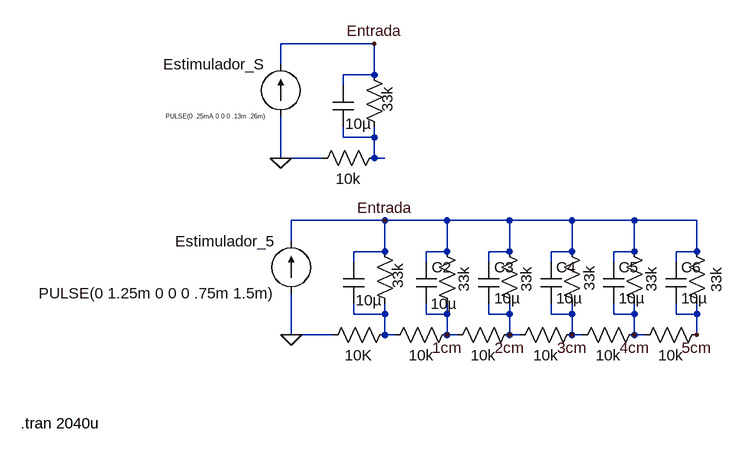
[diagram p0: schematic Simulacion Nervio Vago.asc]
Simulacion Nervio Vago.asc, the LTspice schematic file:
Version 4
SHEET 1 880 680
WIRE -32 -224 -176 -224
WIRE -176 -192 -176 -224
WIRE -32 -176 -32 -224
WIRE -32 -176 -80 -176
WIRE -80 -160 -80 -176
WIRE -80 -80 -80 -96
WIRE -32 -80 -32 -96
WIRE -32 -80 -80 -80
WIRE -176 -48 -176 -112
WIRE -112 -48 -176 -48
WIRE -32 -48 -32 -80
WIRE -16 -48 -32 -48
WIRE -16 48 -160 48
WIRE 80 48 -16 48
WIRE 176 48 80 48
WIRE 272 48 176 48
WIRE 368 48 272 48
WIRE 464 48 368 48
WIRE -160 80 -160 48
WIRE -16 96 -16 48
WIRE -16 96 -64 96
WIRE 80 96 80 48
WIRE 80 96 48 96
WIRE 176 96 176 48
WIRE 176 96 144 96
WIRE 272 96 272 48
WIRE 272 96 240 96
WIRE 368 96 368 48
WIRE 368 96 336 96
WIRE 464 96 464 48
WIRE 464 96 432 96
WIRE -64 112 -64 96
WIRE 48 112 48 96
WIRE 144 112 144 96
WIRE 240 112 240 96
WIRE 336 112 336 96
WIRE 432 112 432 96
WIRE -64 192 -64 176
WIRE -16 192 -16 176
WIRE -16 192 -64 192
WIRE 48 192 48 176
WIRE 80 192 80 176
WIRE 80 192 48 192
WIRE 144 192 144 176
WIRE 176 192 176 176
WIRE 176 192 144 192
WIRE 240 192 240 176
WIRE 272 192 272 176
WIRE 272 192 240 192
WIRE 336 192 336 176
WIRE 368 192 368 176
WIRE 368 192 336 192
WIRE 432 192 432 176
WIRE 464 192 464 176
WIRE 464 192 432 192
WIRE -160 224 -160 160
WIRE -96 224 -160 224
WIRE -16 224 -16 192
WIRE 0 224 -16 224
WIRE 80 224 80 192
WIRE 96 224 80 224
WIRE 176 224 176 192
WIRE 192 224 176 224
WIRE 272 224 272 192
WIRE 288 224 272 224
WIRE 368 224 368 192
WIRE 384 224 368 224
WIRE 464 224 464 192
FLAG -160 224 0
FLAG -16 48 Entrada
FLAG 80 224 1cm
FLAG 176 224 2cm
FLAG 272 224 3cm
FLAG 368 224 4cm
FLAG 464 224 5cm
FLAG -176 -48 0
FLAG -32 -224 Entrada
SYMBOL res 160 80 R0
WINDOW 0 0 0 Invisible 2
WINDOW 3 42 39 VRight 2
SYMATTR InstName R1
SYMATTR Value 33k
SYMBOL res 256 80 R0
WINDOW 0 0 1 Invisible 2
WINDOW 3 43 38 VRight 2
SYMATTR InstName R2
SYMATTR Value 33k
SYMBOL res 352 80 R0
WINDOW 0 -1 1 Invisible 2
WINDOW 3 42 39 VRight 2
SYMATTR InstName R3
SYMATTR Value 33k
SYMBOL res 448 80 R0
WINDOW 0 1 -1 Invisible 2
WINDOW 3 46 40 VRight 2
SYMATTR InstName R4
SYMATTR Value 33k
SYMBOL res 64 80 R0
WINDOW 0 0 1 Invisible 2
WINDOW 3 42 39 VRight 2
SYMATTR InstName R5
SYMATTR Value 33k
SYMBOL res -32 80 R0
WINDOW 0 2 -1 Invisible 2
WINDOW 3 36 34 VRight 2
SYMATTR InstName R6
SYMATTR Value 33k
SYMBOL res 96 208 R90
WINDOW 0 0 56 Invisible 2
WINDOW 3 32 56 VTop 2
SYMATTR InstName R7
SYMATTR Value 10k
SYMBOL res 192 208 R90
WINDOW 0 0 56 Invisible 2
WINDOW 3 32 56 VTop 2
SYMATTR InstName R8
SYMATTR Value 10k
SYMBOL res 288 208 R90
WINDOW 0 0 56 Invisible 2
WINDOW 3 32 56 VTop 2
SYMATTR InstName R9
SYMATTR Value 10k
SYMBOL res 384 208 R90
WINDOW 0 0 56 Invisible 2
WINDOW 3 32 56 VTop 2
SYMATTR InstName R10
SYMATTR Value 10k
SYMBOL res 480 208 R90
WINDOW 0 0 56 Invisible 2
WINDOW 3 32 56 VTop 2
SYMATTR InstName R11
SYMATTR Value 10k
SYMBOL cap -80 112 R0
WINDOW 3 19 59 Left 2
WINDOW 0 24 8 Invisible 2
SYMATTR Value 10µ
SYMATTR InstName C1
SYMBOL cap 32 112 R0
WINDOW 3 23 64 Left 2
SYMATTR Value 10µ
SYMATTR InstName C2
SYMBOL cap 128 112 R0
SYMATTR InstName C3
SYMATTR Value 10µ
SYMBOL cap 224 112 R0
SYMATTR InstName C4
SYMATTR Value 10µ
SYMBOL cap 320 112 R0
SYMATTR InstName C5
SYMATTR Value 10µ
SYMBOL cap 416 112 R0
SYMATTR InstName C6
SYMATTR Value 10µ
SYMBOL current -160 160 R180
WINDOW 0 24 80 Left 2
WINDOW 3 24 0 Left 2
WINDOW 123 0 0 Left 0
WINDOW 39 0 0 Left 0
SYMATTR InstName Estimulador_5
SYMATTR Value PULSE(0 1.25m 0 0 0 .75m 1.5m)
SYMBOL res 0 208 R90
WINDOW 0 0 56 Invisible 2
WINDOW 3 32 56 VTop 2
SYMATTR InstName R12
SYMATTR Value 10K
SYMBOL res -48 -192 R0
WINDOW 0 2 -1 Invisible 2
WINDOW 3 36 34 VRight 2
SYMATTR InstName R13
SYMATTR Value 33k
SYMBOL cap -96 -160 R0
WINDOW 3 19 59 Left 2
WINDOW 0 24 8 Invisible 2
SYMATTR Value 10µ
SYMATTR InstName C7
SYMBOL current -176 -112 R180
WINDOW 0 24 80 Left 2
WINDOW 3 24 0 Left 0
WINDOW 123 0 0 Left 0
WINDOW 39 0 0 Left 0
SYMATTR InstName Estimulador_S
SYMATTR Value PULSE(0 .25mA 0 0 0 .13m .26m)
SYMBOL res -16 -64 R90
WINDOW 0 0 56 Invisible 2
WINDOW 3 32 56 VTop 2
SYMATTR InstName R14
SYMATTR Value 10k
TEXT -576 360 Left 2 !.tran 2040u

The netlist it stands for:
* Simulacion Nervio Vago.asc
R1 Entrada 2cm 33k
R2 Entrada 3cm 33k
R3 Entrada 4cm 33k
R4 Entrada 5cm 33k
R5 Entrada 1cm 33k
R6 Entrada N002 33k
R7 1cm N002 10k
R8 2cm 1cm 10k
R9 3cm 2cm 10k
R10 4cm 3cm 10k
R11 5cm 4cm 10k
C1 Entrada N002 10µ
C2 Entrada 1cm 10µ
C3 Entrada 2cm 10µ
C4 Entrada 3cm 10µ
C5 Entrada 4cm 10µ
C6 Entrada 5cm 10µ
I§Estimulador_5 0 Entrada PULSE(0 1.25m 0 0 0 .75m 1.5m)
R12 N002 0 10K
R13 Entrada N001 33k
C7 Entrada N001 10µ
I§Estimulador_S 0 Entrada PULSE(0 .25mA 0 0 0 .13m .26m)
R14 N001 0 10k
.tran 2040u
.backanno
.end